# Altium project PCB_Project.PrjPcb
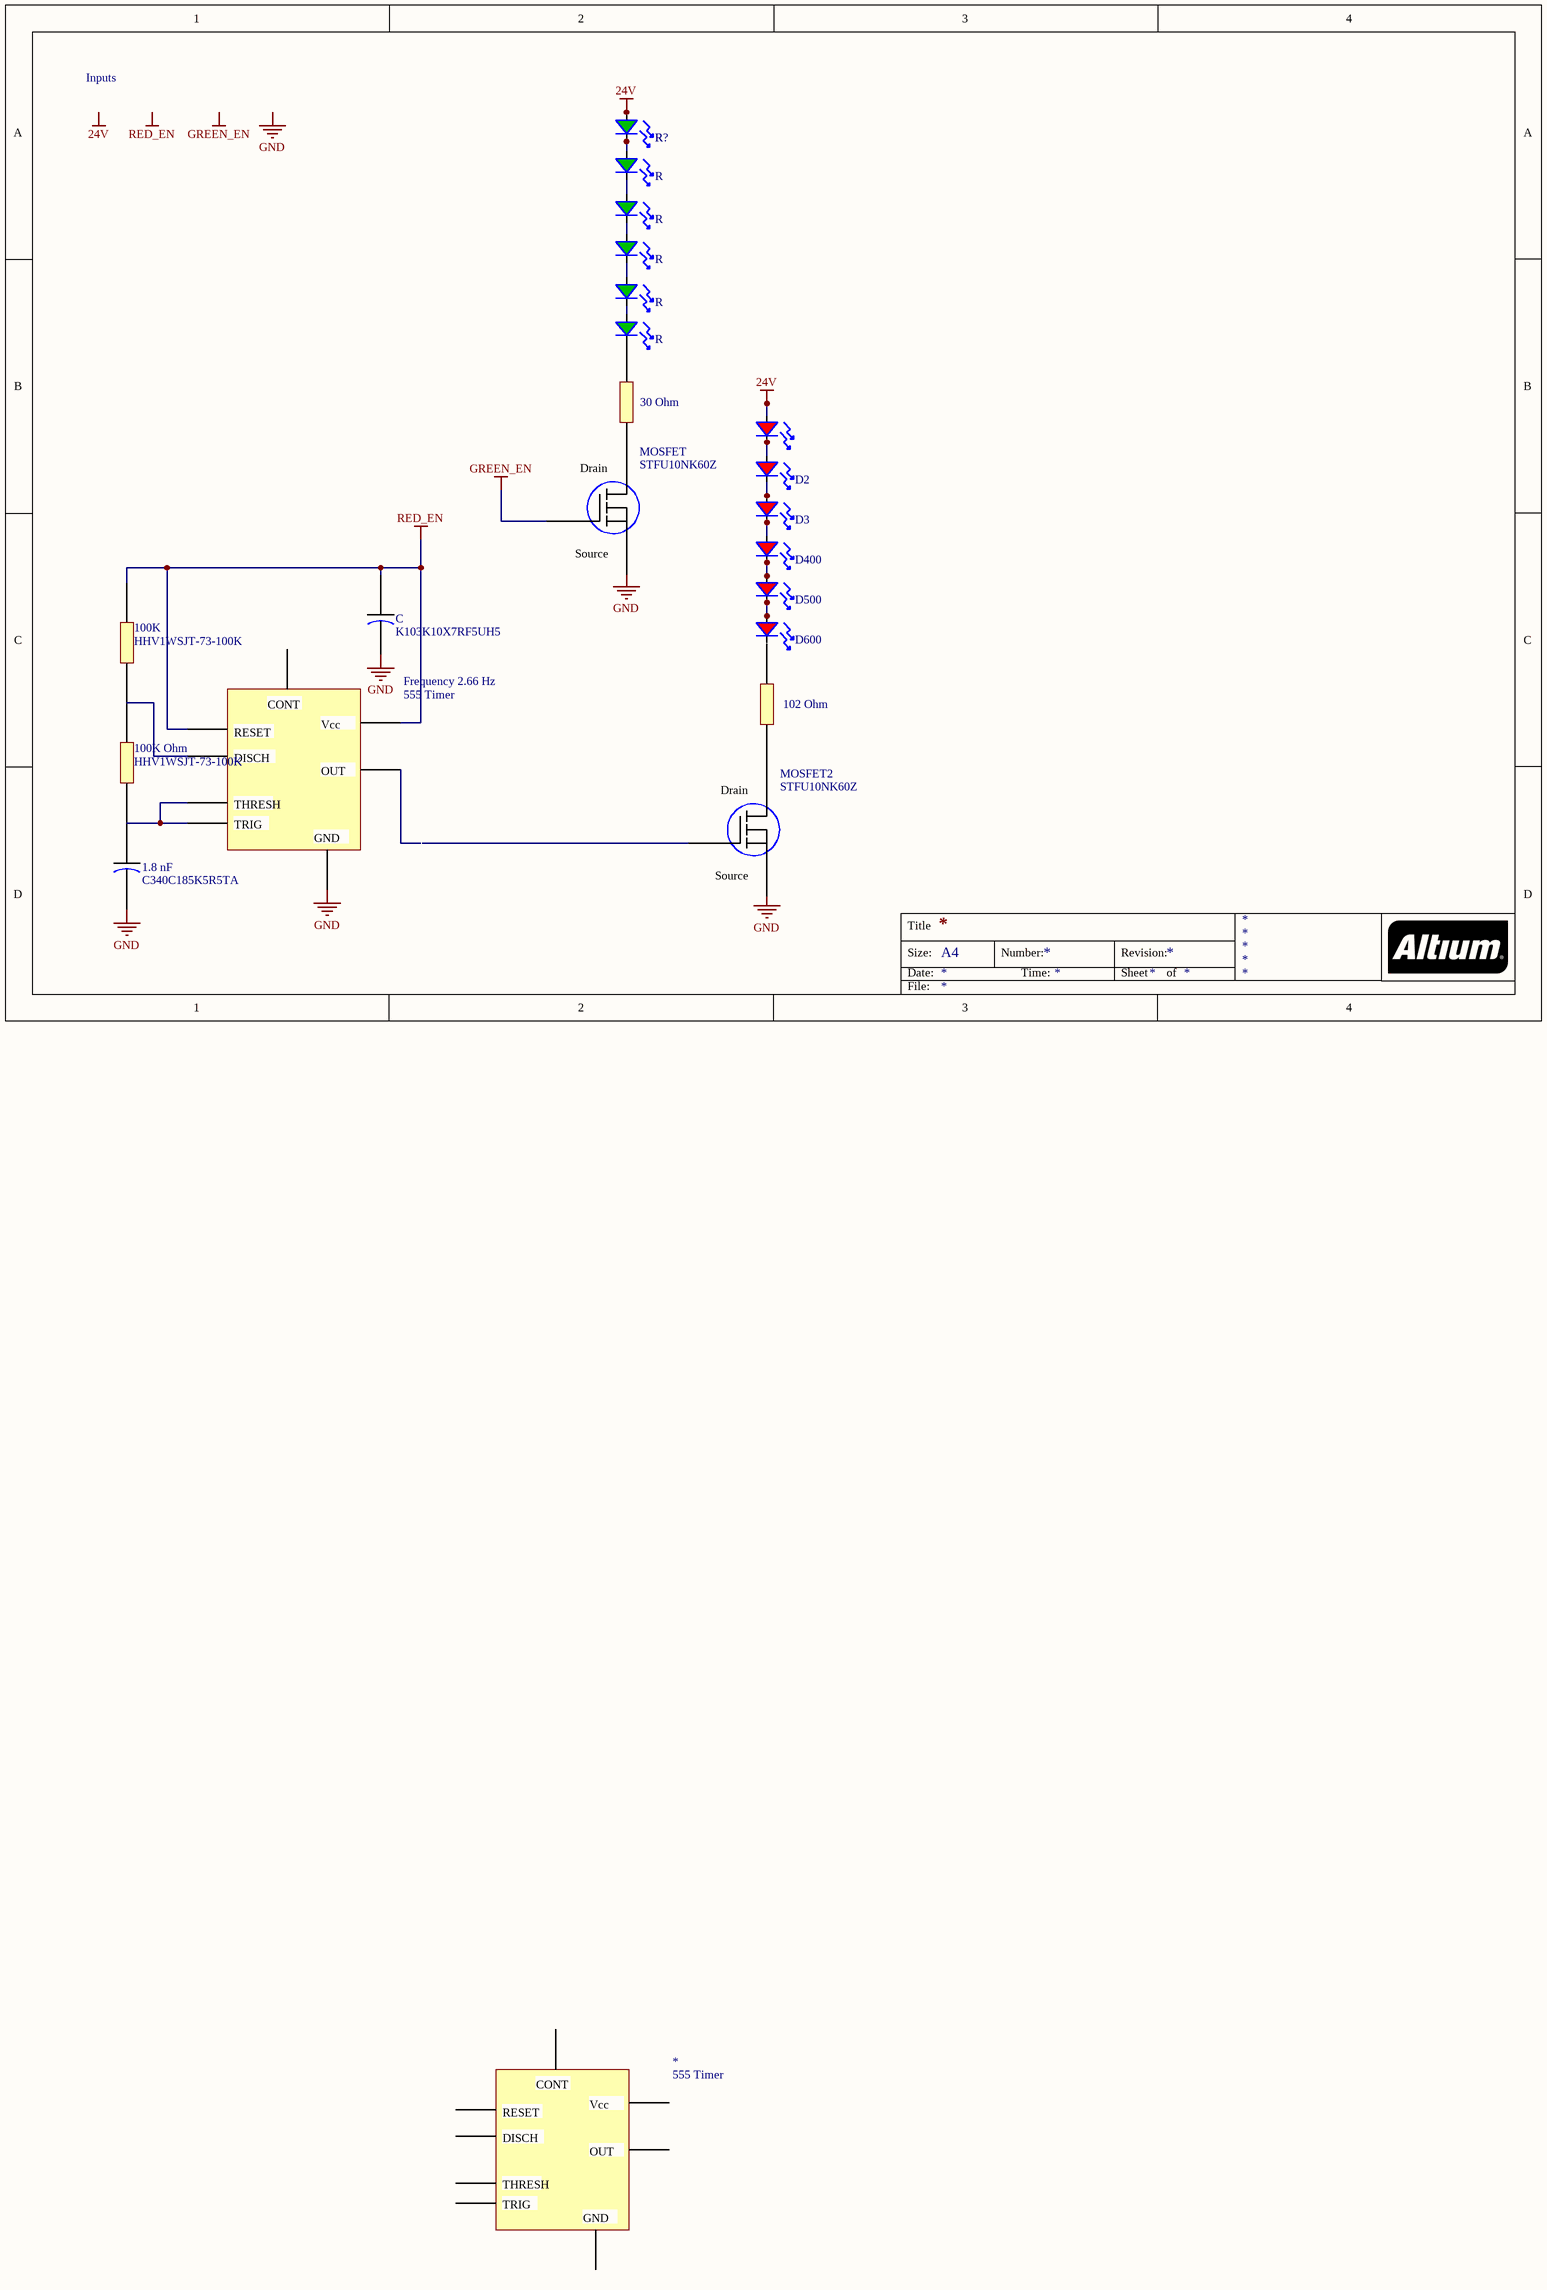
[diagram p0: KevinChenTSAL.SchDoc]
1 sheet, 23 parts. Net scope: global (net labels, ports and power ports of the same name join across sheets).
Board file: PCB2.PcbDoc

## Sheet KevinChenTSAL.SchDoc
size A4

### Parts
(Parts that share a designator on the sheet are numbered #1, #2 ... from top to bottom, then left to right.)
1.8_nF  C340C185K5R5TA  [Capacitor]
30_Ohm  CW02B30R00JE12HE  [Resistor 100k]  (value not drawn)
100K  HHV1WSJT-73-100K  [Resistor 100k]
100K_Ohm  HHV1WSJT-73-100K  [Resistor 100k]
102_Ohm  MRS25000C1020FRP00  [Resistor 100k]  (value not drawn)
*  555 Timer  [DIP8]
?  OVS5MRBCR4  [RED LED]  (value not drawn)
C  K103K10X7RF5UH5  [Capacitor]
D2  OVS5MRBCR4  [RED LED]  (value not drawn)
D3  OVS5MRBCR4  [RED LED]  (value not drawn)
D400  OVS5MRBCR4  [RED LED]  (value not drawn)
D500  OVS5MRBCR4  [RED LED]  (value not drawn)
D600  OVS5MRBCR4  [RED LED]  (value not drawn)
Frequency_2.66_Hz  555 Timer  [DIP8]
MOSFET  STFU10NK60Z  [PCBComponent_1 - duplicate]
MOSFET2  STFU10NK60Z  [PCBComponent_1 - duplicate]
R#1  XZDG25X109FS  [GREEN LED]  (value not drawn)
R#2  XZDG25X109FS  [GREEN LED]  (value not drawn)
R#3  XZDG25X109FS  [GREEN LED]  (value not drawn)
R#4  XZDG25X109FS  [GREEN LED]  (value not drawn)
R#5  XZDG25X109FS  [GREEN LED]  (value not drawn)
R#6  XZDG25X109FS  [GREEN LED]  (value not drawn)
R?  XZDG25X109FS  [GREEN LED]  (value not drawn)

### Nets
24V: ?.1 R#1.1 R?.1
Net?_2: ?.2(s) D2.1
NetD2_2: D2.2(s) D3.1
NetD3_2: D3.2(s) D400.1
NetD400_2: D400.2(s) D500.1
NetD500_2: D500.2(s) D600.1
NetR#1_2: R#1.2 R#2.1 R?.2
NetR#2_2: R#2.2 R#3.1
NetR#3_2: R#3.2 R#4.1
NetR#4_2: R#4.2 R#5.1
NetR#5_2: R#5.2 R#6.1

Not connected (* = marked no-connect by the designer): 1.8_nF 44 45; 30_Ohm 22 23; 100K 22 23; 100K_Ohm 22 23; 102_Ohm 22 23; * 36 37 38 39 40 41 42 43; C 46 47; D600 2(s); Frequency_2.66_Hz 36 37 38 39 40 41 42 43; MOSFET 1 2 3; MOSFET2 1 2 3; R#6 2

### Notes on the sheet
- Inputs
- Labels drawn without touching a wire or pin: 24V, GND, GREEN_EN, RED_EN
- Title
- Size:
- Date:
- A4
- Number:
- Time:
- Revision:
- Sheet
- of
- File:
- (in symbol NE555DR) CONT; Vcc; RESET; DISCH; OUT; THRESH; TRIG; GND
- (in symbol STFU10NK60Z) Drain; Gate; Source

### Library data of the parts
1.8_nF = C340C185K5R5TA: Cap Ceramic 1.8uF 50V X7R 10% Radial 5.08mm 125C Bulk; Manufacturer: KEMET; Dissipation Factor: 2.5%; Supplier 1: Digi-Key; Manufacturer Part Number: C340C185K5R5TA; RoHS: Yes; Category: Ceramic Capacitors; Stock 1: 200; Pricing 1: 1=3.18000, 10=2.57100, 50=2.24400, 100=1.96350, 500=1.49600, 1000=1.30900, 2500=1.26225, 5000=1.21550 (USD); Mount: Through Hole; Case/Package: Dipped; Min Operating Temperature: -55°C; Max Operating Temperature: 125°C; Dielectric: X7R; Termination: Radial; Capacitance: 1.8uF; Tolerance: 10%; Packaging: Bulk; Voltage Rating (DC): 50V; Package Quantity: 100; Voltage Rating: 50V; Length: 11.68mm; Width: 10.16mm; Height: 3.81mm; Depth: 3.81mm; Lead Pitch: 5.08mm; Radiation Hardening: No; ComponentLink1URL: http://www.mouser.com/ds/2/212/KEM_C1051_GOLDMAX_Z5U-1140498.pdf?src-supplier=Mouser; ComponentLink1Description: http://www.mouser.com/ds/2/212/KEM_C1051_GOLDMAX_Z5U-1140498.pdf?src-supplier=Mouser; ComponentLink2URL: http://components.arrow.com/part/dataview/42217397S8633275N7429?src-supplier=Arrow+Electronics; ComponentLink2Description: http://components.arrow.com/part/dataview/42217397S8633275N7429?src-supplier=Arrow+Electronics; ComponentLink3URL: http://capacitoredge.kemet.com/capedge2/DataSheet?pn=C340C185K5R5CA&src-supplier=Avnet; ComponentLink3Description: http://capacitoredge.kemet.com/capedge2/DataSheet?pn=C340C185K5R5CA&src-supplier=Avnet; ComponentLink4URL: http://capacitoredge.kemet.com/capedge2/DataSheet?pn=C340C185K5R5CA&src-supplier=Avnet+Europe; ComponentLink4Description: http://capacitoredge.kemet.com/capedge2/DataSheet?pn=C340C185K5R5CA&src-supplier=Avnet+Europe; Supplier Part Number 1: 399-C340C185K5R5TA-ND
30_Ohm = CW02B30R00JE12HE: Res, 30R, 5%, 3.75W, Axial, Wirewound; Manufacturer: Vishay; Temperature Coefficient: 30ppm/°C; Supplier 1: Digi-Key; Manufacturer Part Number: CW02B30R00JE12HE; RoHS: Yes; Category: Through-Hole Resistors; Stock 1: 125; Pricing 1: 1=3.03000, 10=2.69000, 25=2.49400, 50=2.34720, 100=2.05380, 250=1.76040, 500=1.46700, 1000=1.27140, 5000=1.23228 (USD); Mount: Through Hole; Case/Package: Axial; Min Operating Temperature: -65°C; Max Operating Temperature: 350°C; Tolerance: 5%; Max Power Dissipation: 3.75W; Packaging: Bulk; Resistance: 30R; Power Rating: 3.75W; Resistor Type: Wirewound; Number of Terminations: 2; Length: 0.562inch; REACH SVHC: Unknown; ComponentLink1URL: http://www.farnell.com/datasheets/2018239.pdf?src-supplier=Farnell; ComponentLink1Description: http://www.farnell.com/datasheets/2018239.pdf?src-supplier=Farnell; ComponentLink2URL: http://www.farnell.com/datasheets/2015622.pdf?src-supplier=Farnell; ComponentLink2Description: http://www.farnell.com/datasheets/2015622.pdf?src-supplier=Farnell; ComponentLink3URL: http://www.vishay.com/docs/30215/cw.pdf?src-supplier=Avnet; ComponentLink3Description: http://www.vishay.com/docs/30215/cw.pdf?src-supplier=Avnet; ComponentLink4URL: http://www.farnell.com/datasheets/2015622.pdf?src-supplier=Element14; ComponentLink4Description: http://www.farnell.com/datasheets/2015622.pdf?src-supplier=Element14; ComponentLink5URL: http://www.farnell.com/datasheets/2018239.pdf?src-supplier=Element14; ComponentLink5Description: http://www.farnell.com/datasheets/2018239.pdf?src-supplier=Element14; ComponentLink6URL: http://www.vishay.com/whatsnew/doc/npi_150701-NPI-Revised-Clean-ANewEdit-Resistors-Dale-CWHighEnergy.pdf?src-supplier=Digi-Key; ComponentLink6Description: http://www.vishay.com/whatsnew/doc/npi_150701-NPI-Revised-Clean-ANewEdit-Resistors-Dale-CWHighEnergy.pdf?src-supplier=Digi-Key; Supplier Part Number 1: 541-2759-ND
100K 100K_Ohm = HHV1WSJT-73-100K: Res 100K Ohm 1W 5% Axial; Manufacturer: Yageo; Resistance: 100kR; Supplier 1: Digi-Key; Manufacturer Part Number: HHV1WSJT-73-100K; RoHS: Yes; Category: Through-Hole Resistors; Stock 1: 2598; Pricing 1: 1=0.60000, 10=0.45900, 25=0.34920, 50=0.25960, 100=0.19300, 250=0.16304, 500=0.13974 (USD); Case/Package: Axial; Min Operating Temperature: -55°C; Max Operating Temperature: 155°C; Tolerance: 5%; Features: Flame Retardant Coating; Package Quantity: 1; Packaging: Tape and Reel; Resistor Type: Metal Film; Number of Terminations: 2; Max Power Dissipation: 1W; Length: 0.453inch; ComponentLink1URL: https://datasheet.ciiva.com/2722/yageolr-hhv-2013-2722347.pdf?src-supplier=Digi-Key; ComponentLink1Description: https://datasheet.ciiva.com/2722/yageolr-hhv-2013-2722347.pdf?src-supplier=Digi-Key; ComponentLink2URL: https://datasheet.ciiva.com/2722/yageolr-hhv-2013-2722346.pdf?src-supplier=Digi-Key; ComponentLink2Description: https://datasheet.ciiva.com/2722/yageolr-hhv-2013-2722346.pdf?src-supplier=Digi-Key; Supplier Part Number 1: 100KBJCT-ND
102_Ohm = MRS25000C1020FRP00: RES 102 OHM 0.6W 1% AXIAL; Manufacturer: Vishay BCcomponents; Max Power Dissipation: 600mW; Resistance: 102R; Voltage Rating: 350V; Temperature Coefficient: 50ppm/°C; Lead Diameter: 0.6mm; Supplier 1: Digi-Key; Manufacturer Part Number: MRS25000C1020FRP00; RoHS: Yes; Category: Through-Hole Resistors; Stock 1: 59; Pricing 1: 1=0.26000, 10=0.22000, 25=0.16000, 50=0.11600, 100=0.08600, 250=0.06600, 500=0.05200, 1000=0.03600 (USD); Mount: Through Hole; Case/Package: Axial; Contact Plating: Tin; Min Operating Temperature: -55°C; Max Operating Temperature: 155°C; Power Rating: 600mW; Tolerance: 1%; Package Quantity: 1; Packaging: Tape and Reel; Termination: Axial; Resistor Type: Thin Film,Metal Film; Number of Terminations: 2; Diameter: 2.5mm; Length: 6.5mm; Width: 2.5mm; Lead Free: Lead Free; ComponentLink1URL: https://datasheet.ciiva.com/5610/mrs16m25-239694-5610629.pdf?src-supplier=Mouser; ComponentLink1Description: https://datasheet.ciiva.com/5610/mrs16m25-239694-5610629.pdf?src-supplier=Mouser; ComponentLink2URL: https://datasheet.ciiva.com/2710/mrs16m25-2710840.pdf?src-supplier=Digi-Key; ComponentLink2Description: https://datasheet.ciiva.com/2710/mrs16m25-2710840.pdf?src-supplier=Digi-Key; ComponentLink3URL: https://datasheet.ciiva.com/2710/mrs16m25-2710841.pdf?src-supplier=Digi-Key; ComponentLink3Description: https://datasheet.ciiva.com/2710/mrs16m25-2710841.pdf?src-supplier=Digi-Key; ComponentLink4URL: https://datasheet.ciiva.com/8398/mrs16m25-8398239.pdf?src-supplier=Avnet; ComponentLink4Description: https://datasheet.ciiva.com/8398/mrs16m25-8398239.pdf?src-supplier=Avnet; Supplier Part Number 1: PPC102ZCT-ND
* Frequency_2.66_Hz = NE555DR: TEXAS INSTRUMENTS         NE555DR.             TIMER, SINGLE, 500KHZ, 16V, SOIC-8; Min Supply Voltage: 4.5V; Frequency: 100kHz; Number of Timers/Counters: 1; Operating Supply Current: 10mA; High Level Output Current: -200mA; Low Level Output Current: 200mA; Quiescent Current: 15mA; Supplier 1: Digi-Key; Manufacturer: Texas Instruments; Manufacturer Part Number: NE555DR; RoHS: Yes; Category: Timers and Oscillators; Stock 1: 41325; Pricing 1: 1=0.36000, 10=0.27500, 25=0.24760, 100=0.17100, 250=0.14400, 500=0.11700, 1000=0.09000 (USD); Mount: Surface Mount; Case/Package: SOIC; Number of Pins: 8; Weight: 0.002561oz; Contact Plating: Gold; Min Operating Temperature: 0°C; Max Operating Temperature: 70°C; Max Supply Voltage: 16V; Packaging: Tape and Reel; Package Quantity: 2500; Length: 4.9mm; Width: 3.91mm; Height: 1.58mm; Radiation Hardening: No; REACH SVHC: No SVHC; Lead Free: Lead Free; ComponentLink1URL: https://datasheet.ciiva.com/26251/se555m-26251288.pdf?src-supplier=Avnet+Europe; ComponentLink1Description: https://datasheet.ciiva.com/26251/se555m-26251288.pdf?src-supplier=Avnet+Europe; ComponentLink2URL: https://datasheet.ciiva.com/16465/se555m-16465210.pdf?src-supplier=Avnet+Asia; ComponentLink2Description: https://datasheet.ciiva.com/16465/se555m-16465210.pdf?src-supplier=Avnet+Asia; ComponentLink3URL: https://datasheet.ciiva.com/1233/ne555-1233131.pdf?src-supplier=Digi-Key; ComponentLink3Description: https://datasheet.ciiva.com/1233/ne555-1233131.pdf?src-supplier=Digi-Key; ComponentLink4URL: https://datasheet.ciiva.com/1139/1874740-1139901.pdf?src-supplier=Element14; ComponentLink4Description: https://datasheet.ciiva.com/1139/1874740-1139901.pdf?src-supplier=Element14; ComponentLink5URL: https://datasheet.ciiva.com/1233/ne555-1233133.pdf?src-supplier=Digi-Key; ComponentLink5Description: https://datasheet.ciiva.com/1233/ne555-1233133.pdf?src-supplier=Digi-Key; Supplier Part Number 1: 296-6501-1-ND
? D2 D3 D400 D500 D600 = RED LED: Red 625nm LED Indication - Discrete 2.2V 2-SMD, No Lead; Supplier 1: Digikey; Supplier Part Number 1: 365-1546-1-ND
C = K103K10X7RF5UH5: CAP CER 10000PF 50V X7R RADIAL; Manufacturer: Vishay BCcomponents; Lead/Base Style: Formed Leads; Capacitance: 10nF; Tolerance: 10%; Supplier 1: Digi-Key; Manufacturer Part Number: K103K10X7RF5UH5; RoHS: Yes; Category: Ceramic Capacitors; Stock 1: 34049; Pricing 1: 1=0.18000, 10=0.12000, 50=0.07180, 100=0.06060, 500=0.04150, 1000=0.03671 (USD); Mount: Through Hole; Case/Package: Dipped; Weight: 0.003527oz; Min Operating Temperature: -55°C; Max Operating Temperature: 125°C; Package Quantity: 1; Voltage Rating: 50V; Packaging: Ammo Pack; Termination: Radial; Voltage Rating (DC): 50V; Dielectric: X7R; Diameter: 500um; Length: 0.142inch; Width: 0.091inch; Lead Pitch: 0.197inch; Height - Seated (Max): 0.242inch; Depth: 2.3mm; Radiation Hardening: No; ComponentLink1URL: https://datasheet.ciiva.com/16624/kseries-16624262.pdf?src-supplier=Avnet+Europe; ComponentLink1Description: https://datasheet.ciiva.com/16624/kseries-16624262.pdf?src-supplier=Avnet+Europe; ComponentLink2URL: https://datasheet.ciiva.com/145/kseries-145331.pdf?src-supplier=Digi-Key; ComponentLink2Description: https://datasheet.ciiva.com/145/kseries-145331.pdf?src-supplier=Digi-Key; ComponentLink3URL: https://datasheet.ciiva.com/145/kseries-145332.pdf?src-supplier=Digi-Key; ComponentLink3Description: https://datasheet.ciiva.com/145/kseries-145332.pdf?src-supplier=Digi-Key; ComponentLink4URL: https://datasheet.ciiva.com/11591/kseries-11591663.pdf?src-supplier=Avnet; ComponentLink4Description: https://datasheet.ciiva.com/11591/kseries-11591663.pdf?src-supplier=Avnet; Supplier Part Number 1: BC2662CT-ND
MOSFET MOSFET2 = STFU10NK60Z: N-channel 600 V, 0.68 Ohm typ., 10 A SuperMESH Power MOSFET in TO-220FP ultra narrow leads package; Manufacturer: STMicroelectronics; Drain to Source Voltage (Vdss): 600V; Continuous Drain Current (ID): 10A; Rds On Max: 750mR; Input Capacitance: 1.37nF; Max Power Dissipation: 35W; Supplier 1: Digi-Key; Manufacturer Part Number: STFU10NK60Z; RoHS: No; Stock 1: 1889; Pricing 1: 1=1.25000, 10=1.12100, 25=1.06400, 100=0.79800, 500=0.67640, 1000=0.55100, 2500=0.54340, 5000=0.49400, 9000=0.47120 (USD); Mount: Through Hole; Case/Package: TO-220-3; Min Operating Temperature: -55°C; Max Operating Temperature: 150°C; ComponentLink1URL: http://www.st.com/content/ccc/resource/technical/document/datasheet/group1/9e/e8/14/9d/19/25/4e/12/DM00256590/files/DM00256590.pdf/jcr:content/translations/en.DM00256590.pdf?src-supplier=Digi-Key; ComponentLink1Description: http://www.st.com/content/ccc/resource/technical/document/datasheet/group1/9e/e8/14/9d/19/25/4e/12/DM00256590/files/DM00256590.pdf/jcr:content/translations/en.DM00256590.pdf?src-supplier=Digi-Key; Supplier Part Number 1: 497-STFU10NK60Z-ND
R#1-R#6 R? = GREEN LED: Green 525nm LED Indication - Discrete 3.5V 1411 (3528 Metric); Supplier 1: Digikey; Supplier Part Number 1: 1497-1345-1-ND